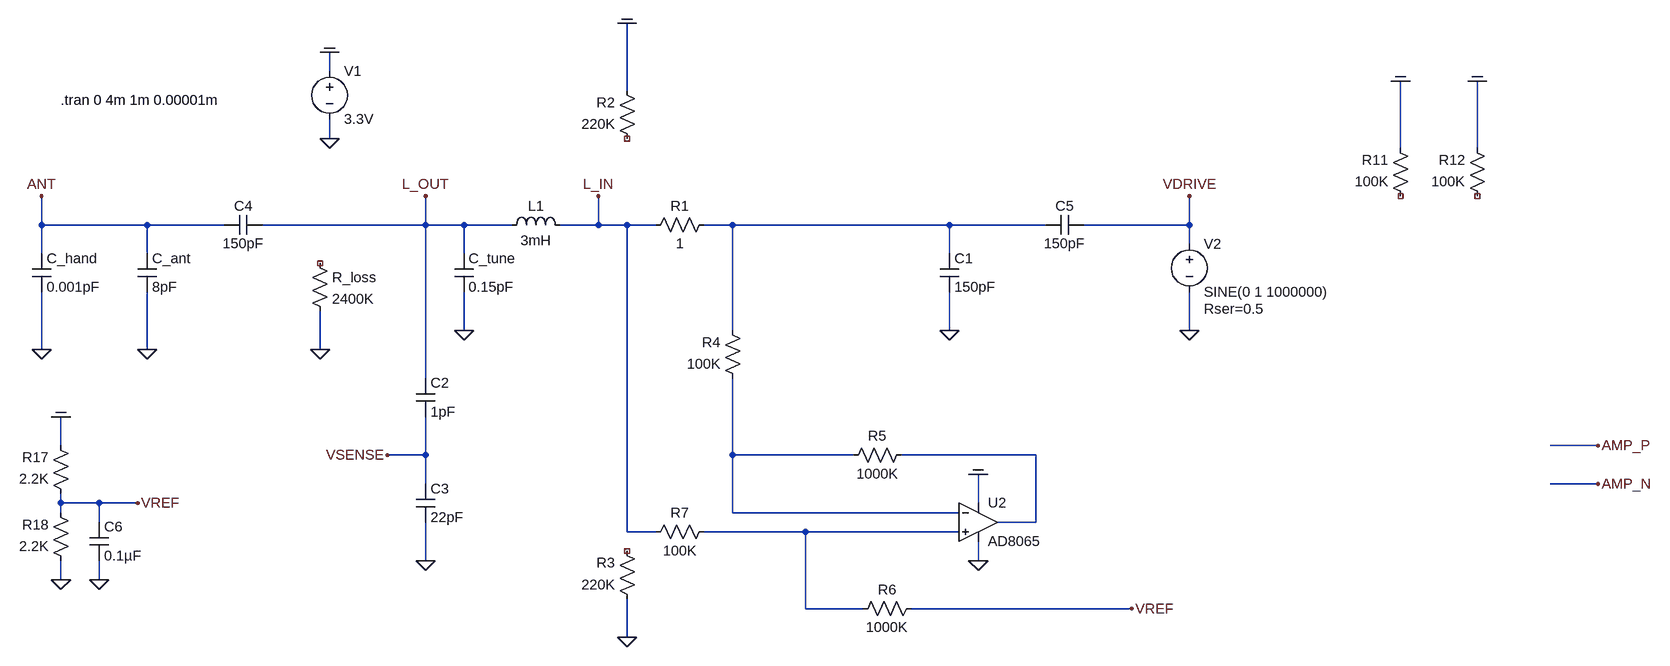
[diagram p0: schematic 2020_oscillator_experiments_v3.asc]
2020_oscillator_experiments_v3.asc, the LTspice schematic file:
Version 4
SHEET 1 3244 1252
WIRE 0 80 0 48
WIRE 496 112 496 0
WIRE 0 192 0 160
WIRE 1792 208 1792 96
WIRE 1920 208 1920 96
WIRE -480 336 -480 288
WIRE -304 336 -480 336
WIRE -176 336 -304 336
WIRE 160 336 160 288
WIRE 160 336 -112 336
WIRE 224 336 160 336
WIRE 304 336 224 336
WIRE 448 336 448 288
WIRE 448 336 384 336
WIRE 496 336 448 336
WIRE 544 336 496 336
WIRE 672 336 624 336
WIRE 1040 336 672 336
WIRE 1200 336 1040 336
WIRE 1440 336 1440 288
WIRE 1440 336 1264 336
WIRE 1440 368 1440 336
WIRE -480 384 -480 336
WIRE -304 384 -304 336
WIRE 224 384 224 336
WIRE 1040 384 1040 336
WIRE 224 512 224 448
WIRE 672 512 672 336
WIRE 1040 512 1040 448
WIRE 1440 512 1440 448
WIRE -480 544 -480 448
WIRE -304 544 -304 448
WIRE -16 544 -16 480
WIRE 160 592 160 336
WIRE -448 704 -448 656
WIRE 2688 704 2608 704
WIRE 160 720 160 656
WIRE 160 720 96 720
WIRE 672 720 672 592
WIRE 880 720 672 720
WIRE 1184 720 960 720
WIRE 160 768 160 720
WIRE 2688 768 2608 768
WIRE -448 800 -448 784
WIRE -384 800 -448 800
WIRE -320 800 -384 800
WIRE 1088 800 1088 752
WIRE -448 816 -448 800
WIRE 672 816 672 720
WIRE 1056 816 672 816
WIRE -384 832 -384 800
WIRE 1184 832 1184 720
WIRE 1184 832 1120 832
WIRE 496 848 496 336
WIRE 544 848 496 848
WIRE 800 848 624 848
WIRE 1056 848 800 848
WIRE 160 896 160 832
WIRE 1088 896 1088 864
WIRE -448 928 -448 896
WIRE -384 928 -384 896
WIRE 800 976 800 848
WIRE 896 976 800 976
WIRE 1344 976 976 976
WIRE 496 1024 496 960
FLAG 0 192 0
FLAG 0 48 COM
FLAG -480 288 ANT
FLAG -480 544 0
FLAG -304 544 0
FLAG 1040 512 0
FLAG 160 896 0
FLAG -16 544 0
FLAG 1440 512 0
FLAG 1440 288 VDRIVE
FLAG 96 720 VSENSE
FLAG 496 1024 0
FLAG 496 0 COM
FLAG 448 288 L_IN
FLAG 160 288 L_OUT
FLAG 224 512 0
FLAG 2688 704 AMP_P
FLAG 2688 768 AMP_N
FLAG 1792 96 COM
FLAG 1920 96 COM
FLAG -448 928 0
FLAG -448 656 COM
FLAG -384 928 0
FLAG -320 800 VREF
FLAG 1088 752 COM
FLAG 1088 896 0
FLAG 1344 976 VREF
SYMBOL voltage 0 64 R0
WINDOW 123 0 0 Left 0
WINDOW 39 0 0 Left 0
SYMATTR InstName V1
SYMATTR Value 3.3V
SYMBOL ind 288 352 R270
WINDOW 0 32 56 VTop 2
WINDOW 3 5 56 VBottom 2
SYMATTR InstName L1
SYMATTR Value 3mH
SYMATTR SpiceLine Rser=120 Rpar=20Meg
SYMBOL cap 1024 384 R0
SYMATTR InstName C1
SYMATTR Value 150pF
SYMBOL cap 144 592 R0
SYMATTR InstName C2
SYMATTR Value 1pF
SYMBOL cap 144 768 R0
SYMATTR InstName C3
SYMATTR Value 22pF
SYMBOL cap -320 384 R0
SYMATTR InstName C_ant
SYMATTR Value 8pF
SYMBOL cap -496 384 R0
SYMATTR InstName C_hand
SYMATTR Value 0.001pF
SYMBOL cap -112 320 R90
WINDOW 0 0 32 VBottom 2
WINDOW 3 32 32 VTop 2
SYMATTR InstName C4
SYMATTR Value 150pF
SYMBOL res -32 384 R0
SYMATTR InstName R_loss
SYMATTR Value 2400K
SYMBOL voltage 1440 352 R0
WINDOW 123 0 0 Left 0
WINDOW 39 24 124 Left 2
SYMATTR SpiceLine Rser=0.5
SYMATTR InstName V2
SYMATTR Value SINE(0 1 1000000)
SYMBOL res 640 320 R90
WINDOW 0 0 56 VBottom 2
WINDOW 3 32 56 VTop 2
SYMATTR InstName R1
SYMATTR Value 1
SYMBOL res 512 208 R180
WINDOW 0 36 76 Left 2
WINDOW 3 36 40 Left 2
SYMATTR InstName R2
SYMATTR Value 220K
SYMBOL res 512 976 R180
WINDOW 0 36 76 Left 2
WINDOW 3 36 40 Left 2
SYMATTR InstName R3
SYMATTR Value 220K
SYMBOL cap 1264 320 R90
WINDOW 0 0 32 VBottom 2
WINDOW 3 32 32 VTop 2
SYMATTR InstName C5
SYMATTR Value 150pF
SYMBOL cap 208 384 R0
SYMATTR InstName C_tune
SYMATTR Value 0.15pF
SYMBOL res 1808 304 R180
WINDOW 0 36 76 Left 2
WINDOW 3 36 40 Left 2
SYMATTR InstName R11
SYMATTR Value 100K
SYMBOL res 1936 304 R180
WINDOW 0 36 76 Left 2
WINDOW 3 36 40 Left 2
SYMATTR InstName R12
SYMATTR Value 100K
SYMBOL res -432 800 R180
WINDOW 0 36 76 Left 2
WINDOW 3 36 40 Left 2
SYMATTR InstName R17
SYMATTR Value 2.2K
SYMBOL res -432 912 R180
WINDOW 0 36 76 Left 2
WINDOW 3 36 40 Left 2
SYMATTR InstName R18
SYMATTR Value 2.2K
SYMBOL cap -400 832 R0
SYMATTR InstName C6
SYMATTR Value 0.1µF
SYMBOL res 688 608 R180
WINDOW 0 36 76 Left 2
WINDOW 3 36 40 Left 2
SYMATTR InstName R4
SYMATTR Value 100K
SYMBOL res 864 736 R270
WINDOW 0 32 56 VTop 2
WINDOW 3 0 56 VBottom 2
SYMATTR InstName R5
SYMATTR Value 1000K
SYMBOL res 880 992 R270
WINDOW 0 32 56 VTop 2
WINDOW 3 0 56 VBottom 2
SYMATTR InstName R6
SYMATTR Value 1000K
SYMBOL res 528 864 R270
WINDOW 0 32 56 VTop 2
WINDOW 3 0 56 VBottom 2
SYMATTR InstName R7
SYMATTR Value 100K
SYMBOL Opamps\\AD8065 1088 768 R0
SYMATTR InstName U2
TEXT -448 128 Left 2 !.tran 0 4m 1m 0.00001m

The netlist it stands for:
* 2020_oscillator_experiments_v3.asc
V1 COM 0 3.3V
L1 L_OUT L_IN 3mH Rser=120 Rpar=20Meg
C1 N001 0 150pF
C2 L_OUT VSENSE 1pF
C3 VSENSE 0 22pF
C_ant ANT 0 8pF
C_hand ANT 0 0.001pF
C4 L_OUT ANT 150pF
R_loss NC_01 0 2400K
V2 VDRIVE 0 SINE(0 1 1000000) Rser=0.5
R1 N001 L_IN 1
R2 NC_02 COM 220K
R3 0 NC_03 220K
C5 VDRIVE N001 150pF
C_tune L_OUT 0 0.15pF
R11 NC_04 COM 100K
R12 NC_05 COM 100K
R17 VREF COM 2.2K
R18 0 VREF 2.2K
C6 VREF 0 0.1µF
R4 N002 N001 100K
R5 N002 N003 1000K
R6 N004 VREF 1000K
R7 L_IN N004 100K
XU2 N004 N002 COM 0 N003 AD8065  ; pins In+ In- V+ V- OUT
.tran 0 4m 1m 0.00001m
.backanno
.end